# Altium schematic sheet RIGHT_MOTOR.SchDoc
size A4; SheetNumber: 1; SheetTotal: 3
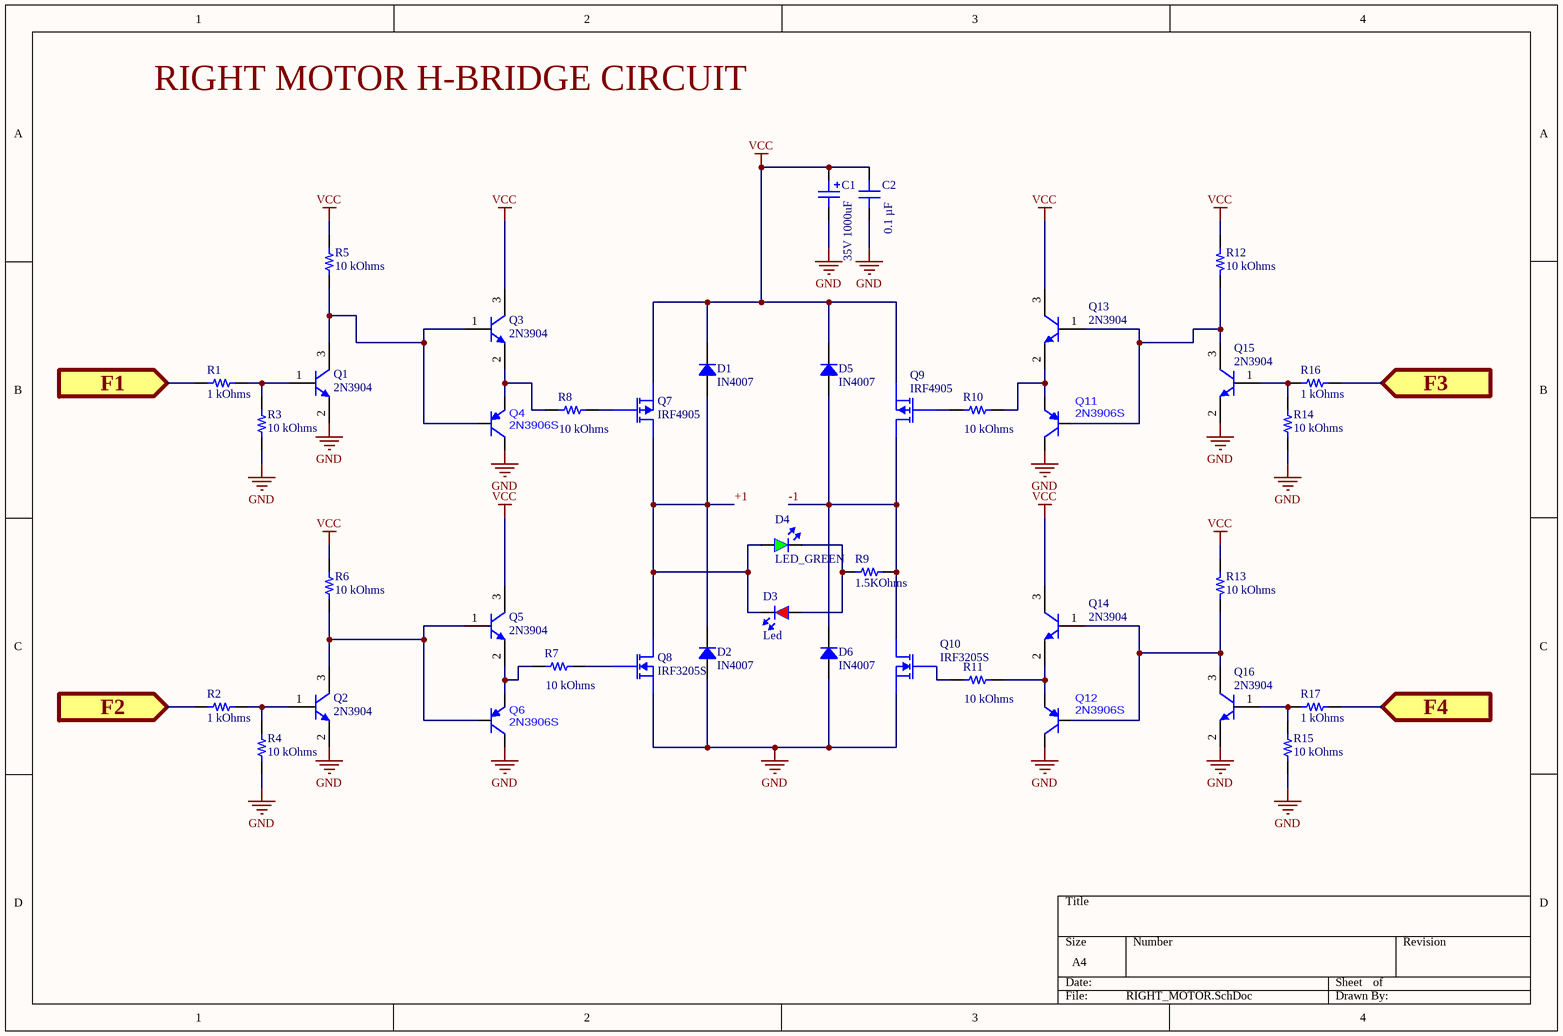
[diagram p0: RIGHT_MOTOR.SchDoc]

## Parts
C1  35V 1000uF  [35V 1000uF]
C2  0.1 µF  [CAP 1210_3225 - 1MM]
D1  IN4007  [DO214AC SMA]
D2  IN4007  [DO214AC SMA]
D3  Led  [LED_RED]
D4  LED_GREEN  [LED_GREEN]
D5  IN4007  [DO214AC SMA]
D6  IN4007  [DO214AC SMA]
Q1  2N3904  [DIODES SOT-23-3]
Q2  2N3904  [DIODES SOT-23-3]
Q3  2N3904  [DIODES SOT-23-3]
Q4  2N3906S  [SOT23-3]
Q5  2N3904  [DIODES SOT-23-3]
Q6  2N3906S  [SOT23-3]
Q7  IRF4905  [IRF4905]
Q8  IRF3205S  [IRF3205S]
Q9  IRF4905  [IRF4905]
Q10  IRF3205S  [IRF3205S]
Q11  2N3906S  [SOT23-3]
Q12  2N3906S  [SOT23-3]
Q13  2N3904  [DIODES SOT-23-3]
Q14  2N3904  [DIODES SOT-23-3]
Q15  2N3904  [DIODES SOT-23-3]
Q16  2N3904  [DIODES SOT-23-3]
R1  1 kOhms  [RES 1206_3216]
R2  1 kOhms  [RES 1206_3216]
R3  10 kOhms  [RES 1206_3216]
R4  10 kOhms  [RES 1206_3216]
R5  10 kOhms  [RES 1210_3225]
R6  10 kOhms  [RES 1210_3225]
R7  10 kOhms  [RES 1210_3225]
R8  10 kOhms  [RES 1210_3225]
R9  1.5KOhms  [RES 1210_3225]
R10  10 kOhms  [RES 1210_3225]
R11  10 kOhms  [RES 1210_3225]
R12  10 kOhms  [RES 1210_3225]
R13  10 kOhms  [RES 1210_3225]
R14  10 kOhms  [RES 1206_3216]
R15  10 kOhms  [RES 1206_3216]
R16  1 kOhms  [RES 1206_3216]
R17  1 kOhms  [RES 1206_3216]

## Ports
F1 (in, see LOGIC AND POWER[2D]), F2 (in, see LOGIC AND POWER[2C], LOGIC AND POWER[2D]), F3 (in, see LOGIC AND POWER[2D]), F4 (in, see LOGIC AND POWER[2C], LOGIC AND POWER[2D])

## Nets
GND: C1.2(out) C2.1 D2.1 D6.1 Q1.2(E) Q2.2(E) Q4.3(C) Q6.3(C) Q8.3(S) Q10.3(S) Q11.3(C) Q12.3(C) Q15.2(E) Q16.2(E) R3.1 R4.1 R14.1 R15.1
VCC: C1.1(in) C2.2 D1.2 D5.2 Q3.3(C) Q5.3(C) Q7.3(S) Q9.3(S) Q13.3(C) Q14.3(C) R5.1 R6.1 R12.1 R13.1
+1: D1.1 D2.2 D3.2(OUT) D4.1(IN) Q7.2(D) Q8.2(D)
-1: D5.1 D6.2 Q9.2(D) Q10.2(D) R9.2
F1: R1.1 ; port F1
F2: R2.1 ; port F2
F3: R16.2 ; port F3
F4: R17.2 ; port F4
NetD3_1: D3.1(IN) D4.2(OUT) R9.1
NetQ1_1: Q1.1(B) R1.2 R3.2
NetQ1_3: Q1.3(C) Q3.1(B) Q4.1(B) R5.2
NetQ2_1: Q2.1(B) R2.2 R4.2
NetQ2_3: Q2.3(C) Q5.1(B) Q6.1(B) R6.2
NetQ3_2: Q3.2(E) Q4.2(E) R8.1
NetQ5_2: Q5.2(E) Q6.2(E) R7.1
NetQ7_1: Q7.1(G) R8.2
NetQ8_1: Q8.1(G) R7.2
NetQ9_1: Q9.1(G) R10.1
NetQ10_1: Q10.1(G) R11.1
NetQ11_1: Q11.1(B) Q13.1(B) Q15.3(C) R12.2
NetQ11_2: Q11.2(E) Q13.2(E) R10.2
NetQ12_1: Q12.1(B) Q14.1(B) Q16.3(C) R13.2
NetQ12_2: Q12.2(E) Q14.2(E) R11.2
NetQ15_1: Q15.1(B) R14.2 R16.1
NetQ16_1: Q16.1(B) R15.2 R17.1

## Notes on the sheet
- Labels drawn without touching a wire or pin: RIGHT MOTOR H-BRIDGE CIRCUIT

## Library data of the parts
C2 = 1210Y0500104KST: 1210 50VDC 100NF 10% X7R(2R1) AE; manufacturer: Knowles Syfer; Voltage - Rated: 50V; Part Number: 1210Y0500104KST; Value: 0.1 µF; Applications: Automotive, Boardflex Sensitive; Capacitance: 0.1 µF; componentlink2description: DigiKey Link; componentlink2url: https://www.digikey.com/en/products/detail/knowles-syfer/1210Y0500104KST/18879780; Device Package: 1210 (3225 Metric); Features: Soft Termination; lastupdated: 4.12.2023 20:40:02; Lifecycle Status: Active; Minimum Order: 1; Mounting Type: Surface Mount, MLCC; Operating Temperature: -55°C ~ 125°C; Package / Case: 1210 (3225 Metric); packaging: TapeAndReel; partid: 53037; Part Status: Active; price: 0.16; Ratings: AEC-Q200; series: FlexiCap™; Size / Dimension: 0.126" L x 0.098" W (3.20mm x 2.50mm); Supplier 1: DigiKey; Supplier Part Number 1: 1608-1210Y0500104KSTCT-ND; Temperature Coefficient: X7R (2R1); Thickness (Max): 0.079" (2.00mm); Tolerance: ±10%
D1 D2 D5 D6 = RS1A: DIODE GEN PURP 50V 1A SMA; Part Number: RS1A; Manufacturer: ON Semiconductor; Capacitance @ Vr, F: 10pF @ 4V, 1MHz; Current - Reverse Leakage @ Vr: 5µA @ 50V; Diode Type: Standard; Reverse Recovery Time (trr): 150ns; Speed: Fast Recovery =< 500ns, > 200mA (Io); Voltage - Forward (Vf) (Max) @ If: 1.3V @ 1A; ComponentLink1Description: Datasheet; ComponentLink1URL: https://www.onsemi.com/pub/Collateral/RS1M-D.PDF; ComponentLink2Description: DigiKey Link; ComponentLink2URL: http://digikey.com/product-detail/en/on-semiconductor/RS1A/RS1ACT-ND/3504478; Current - Average Rectified (Io): 1A; LastUpdated: 4.12.2023 21:20:44; Lifecycle Status: Active; Minimum Order: 1; Mounting Type: Surface Mount; Operating Temperature - Junction: -55°C ~ 150°C; Package / Case: DO-214AC, SMA; Packaging: TapeAndReel; PartId: 585; Part Status: Active; Price: 0.08; Series: -; Supplier 1: DigiKey; Supplier Part Number 1: RS1ACT-ND; Supplier Device Package: SMA (DO-214AC); Voltage - DC Reverse (Vr) (Max): 50V
D3 = LED_RED_1
Q1-Q3 Q5 Q13-Q16 = MMBT3904-7-F: 2N3904 Npn Smd Transistör Sot-23; Manufacturer: Diodes Incorporated; Current - Collector Cutoff (Max): 50nA (ICBO); Current - Collector (Ic) (Max): 200 mA; DC Current Gain (hFE) (Min) @ Ic, Vce: 100 @ 10mA, 1V; Frequency - Transition: 300MHz; Power - Max: 300 mW; Vce Saturation (Max) @ Ib, Ic: 300mV @ 5mA, 50mA; Voltage - Collector Emitter Breakdown (Max): 40 V; Part Number: MMBT3904-7-F; ComponentLink1Description: Datasheet; ComponentLink1URL: https://www.diodes.com/assets/Datasheets/ds30036.pdf; ComponentLink2Description: DigiKey Link; ComponentLink2URL: https://www.digikey.com/en/products/detail/diodes-incorporated/MMBT3904-7-F/814494; LastUpdated: 4.12.2023 21:46:05; Lifecycle Status: Active; Minimum Order: 1; Mounting Type: Surface Mount; Operating Temperature: -55°C ~ 150°C (TJ); Package / Case: TO-236-3, SC-59, SOT-23-3; Packaging: TapeAndReel; PartId: 85; Part Status: Active; Price: 0.01; Series: -; Supplier 1: DigiKey; Supplier Part Number 1: MMBT3904-FDICT-ND; Supplier Device Package: SOT-23-3; Transistor Type: NPN
R1 R2 R16 R17 = RNCS1206BKE1K00: RES 1K OHM 0.1% 1/8W 1206; Manufacturer: Stackpole Electronics Inc; Power (Watts): 0.125W, 1/8W; Temperature Coefficient: ±25ppm/°C; Part Number: RNCS1206BKE1K00; ComponentLink1Description: Datasheet; ComponentLink1URL: https://www.seielect.com/catalog/sei-rncs_rnch.pdf; ComponentLink2Description: DigiKey Link; ComponentLink2URL: https://www.digikey.com/en/products/detail/stackpole-electronics-inc/RNCS1206BKE1K00/1800333; Composition: Thin Film; Device Package: 1206 (3216 Metric); Features: Anti-Corrosive, Automotive AEC-Q200, Moisture Resistant; Height - Seated (Max): 0.026" (0.65mm); LastUpdated: 4.12.2023 20:49:28; Lifecycle Status: Active; Minimum Order: 1; Number of Terminations: 2; Operating Temperature: -55°C ~ 155°C; Package / Case: 1206 (3216 Metric); Packaging: TapeAndReel; PartId: 26856; Part Status: Active; Price: 0.08; Ratings: AEC-Q200; Resistance: 1 kOhms; Series: RNCS; Size / Dimension: 0.120" L x 0.061" W (3.05mm x 1.55mm); Supplier 1: DigiKey; Supplier Part Number 1: RNCS1206BKE1K00CT-ND; Supplier Device Package: 1206; Tolerance: ±0.1%; Value: 1 kOhms
R3 R4 R14 R15 = CRG1206F10K: RES SMD 10K OHM 1% 1/4W 1206; Manufacturer: TE Connectivity Passive Product; Power (Watts): 0.25W, 1/4W; Temperature Coefficient: ±100ppm/°C; Part Number: CRG1206F10K; ComponentLink1Description: Datasheet; ComponentLink1URL: https://www.te.com/commerce/DocumentDelivery/DDEController?Action=srchrtrv&DocNm=1773204&DocType=DS&DocLang=English; ComponentLink2Description: DigiKey Link; ComponentLink2URL: https://www.digikey.com/en/products/detail/te-connectivity-passive-product/CRG1206F10K/2389909; Composition: Thick Film; Device Package: 1206 (3216 Metric); Height - Seated (Max): 0.026" (0.65mm); LastUpdated: 10.12.2023 20:48:33; Lifecycle Status: Active; Minimum Order: 1; Number of Terminations: 2; Operating Temperature: -55°C ~ 155°C; Package / Case: 1206 (3216 Metric); Packaging: TapeAndReel; PartId: 26989; Part Status: Active; Price: 0.01; Resistance: 10 kOhms; Series: CRG, Neohm; Size / Dimension: 0.122" L x 0.061" W (3.10mm x 1.55mm); Supplier 1: DigiKey; Supplier Part Number 1: A106069CT-ND; Supplier Device Package: 1206; Tolerance: ±1%; Value: 10 kOhms
R5 R6 R12 R13 = CRCW121010K0JNEAHP: RES SMD 10K OHM 5% 3/4W 1210; Manufacturer: Vishay Dale; Power (Watts): 0.75W, 3/4W; Temperature Coefficient: ±200ppm/°C; Part Number: CRCW121010K0JNEAHP; ComponentLink1Description: Datasheet; ComponentLink1URL: http://www.vishay.com/docs/20043/crcwhpe3.pdf; ComponentLink2Description: DigiKey Link; ComponentLink2URL: https://www.digikey.com/en/products/detail/vishay-dale/CRCW121010K0JNEAHP/2567300; Composition: Thick Film; Device Package: 1210 (3225 Metric); Features: Automotive AEC-Q200, Pulse Withstanding; Height - Seated (Max): 0.028" (0.70mm); LastUpdated: 4.12.2023 21:41:47; Lifecycle Status: Active; Minimum Order: 1; Number of Terminations: 2; Operating Temperature: -55°C ~ 155°C; Package / Case: 1210 (3225 Metric); Packaging: TapeAndReel; Part Status: Active; Price: 0.12; Ratings: AEC-Q200; Resistance: 10 kOhms; Series: CRCW-HP; Size / Dimension: 0.126" L x 0.098" W (3.20mm x 2.50mm); Supplier 1: DigiKey; Supplier Part Number 1: 541-10KNCT-ND; Supplier Device Package: 1210; Tolerance: ±5%; Value: 10 kOhms
R7 R8 R10 R11 = RMCF1210FT10K0: RES 10K OHM 1% 1/2W 1210; Manufacturer: Stackpole Electronics Inc; Power (Watts): 0.5W, 1/2W; Temperature Coefficient: ±100ppm/°C; Part Number: RMCF1210FT10K0; ComponentLink1Description: Datasheet; ComponentLink1URL: https://www.seielect.com/catalog/sei-rmcf_rmcp.pdf; ComponentLink2Description: DigiKey Link; ComponentLink2URL: https://www.digikey.com/en/products/detail/stackpole-electronics-inc/RMCF1210FT10K0/1758528; Composition: Thick Film; Device Package: 1210 (3225 Metric); Features: Automotive AEC-Q200; Height - Seated (Max): 0.028" (0.70mm); LastUpdated: 10.12.2023 21:39:36; Lifecycle Status: Active; Minimum Order: 1; Number of Terminations: 2; Operating Temperature: -55°C ~ 155°C; Package / Case: 1210 (3225 Metric); Packaging: TapeAndReel; Part Status: Active; Price: 0.01; Ratings: AEC-Q200; Resistance: 10 kOhms; Series: RMCF; Size / Dimension: 0.126" L x 0.098" W (3.20mm x 2.50mm); Supplier 1: DigiKey; Supplier Part Number 1: RMCF1210FT10K0CT-ND; Supplier Device Package: 1210; Tolerance: ±1%; Value: 10 kOhms
R9 = RMCF1210FT10K0: RES 1.5K OHM 1% 1/2W 1210; Manufacturer: Stackpole Electronics Inc; Power (Watts): 0.5W, 1/2W; Resistance: 10 kOhms; Temperature Coefficient: ±100ppm/°C; Value: 10 kOhms; Part Number: RMCF1210FT10K0; ComponentLink1Description: Datasheet; ComponentLink1URL: https://www.seielect.com/catalog/sei-rmcf_rmcp.pdf; ComponentLink2Description: DigiKey Link; ComponentLink2URL: https://www.digikey.com/en/products/detail/stackpole-electronics-inc/RMCF1210FT10K0/1758528; Composition: Thick Film; Device Package: 1210 (3225 Metric); Features: Automotive AEC-Q200; Height - Seated (Max): 0.028" (0.70mm); LastUpdated: 4.12.2023 21:41:44; Lifecycle Status: Active; Minimum Order: 1; Number of Terminations: 2; Operating Temperature: -55°C ~ 155°C; Package / Case: 1210 (3225 Metric); Packaging: TapeAndReel; Part Status: Active; Price: 0.01; Ratings: AEC-Q200; Series: RMCF; Size / Dimension: 0.126" L x 0.098" W (3.20mm x 2.50mm); Supplier 1: DigiKey; Supplier Part Number 1: RMCF1210FT10K0CT-ND; Supplier Device Package: 1210; Tolerance: ±1%